# EAGLE design 2.1 (EAGLE 8.2.2)
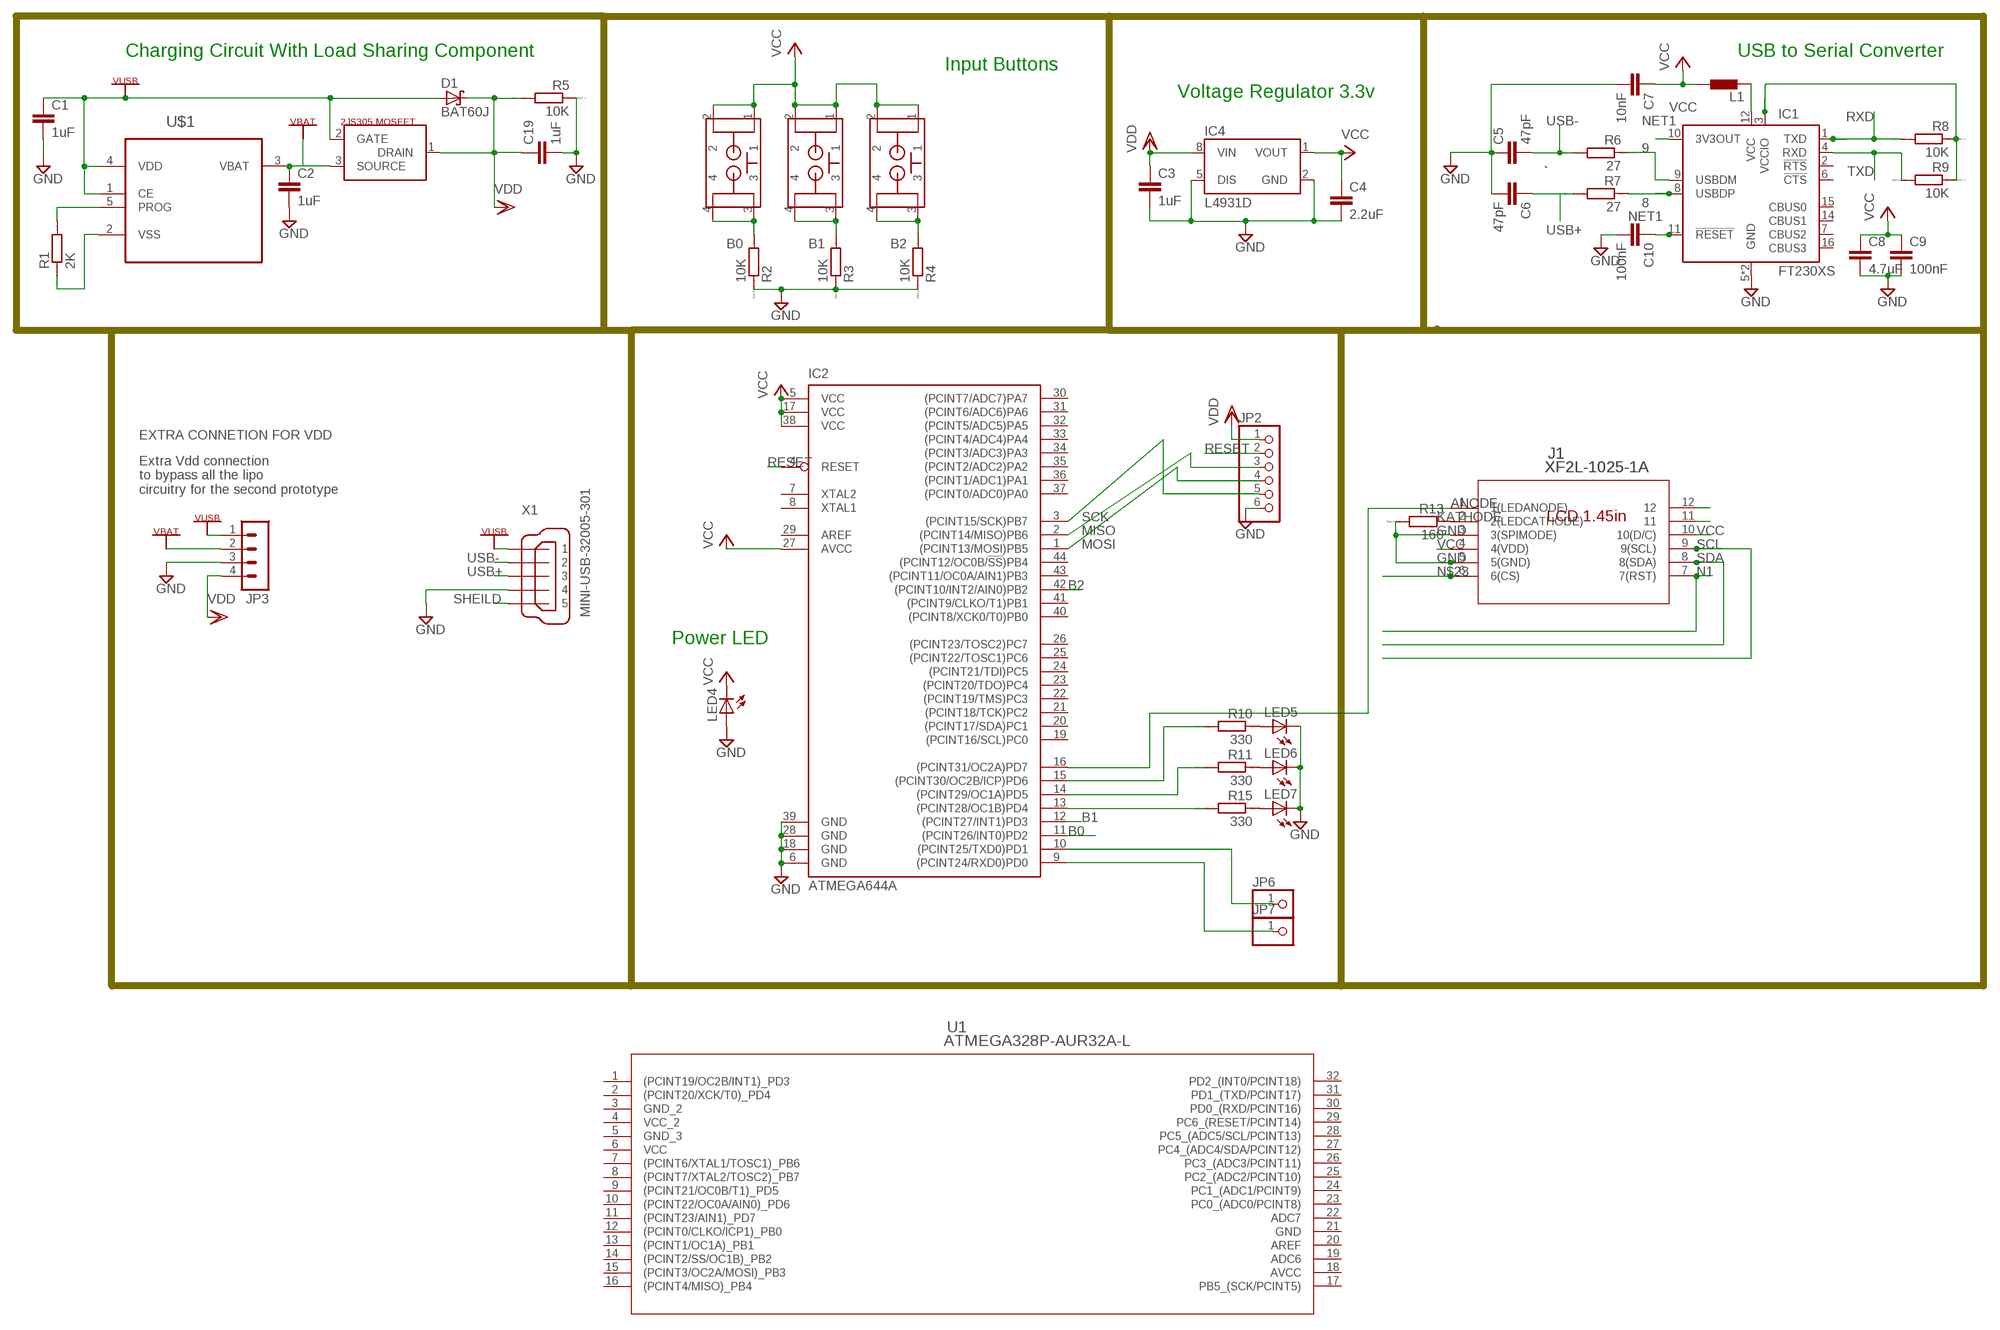
[diagram p0: schematic, sheet 1]

## Parts
C1  1uF  C-EUC0603K  [C0603K]
C2  1uF  C-EUC0603K  [C0603K]
C3  1uF  C-EUC0603K  [C0603K]
C4  2.2uF  C-EUC0603K  [C0603K]
C5  47pF  C-EUC0603K  [C0603K]
C6  47pF  C-EUC0603K  [C0603K]
C7  10nF  C-EUC0603K  [C0603K]
C8  4.7uF  C-EUC0603K  [C0603K]
C9  100nF  C-EUC0603K  [C0603K]
C10  100nF  C-EUC0603K  [C0603K]
C19  1uF  C-EUC0603K  [C0603K]
D1  BAT60J  [SOD323_ST]
IC1  FT230XS  [SSOP16]
IC2  ATMEGA644A  [TQFP44]
IC4  L4931D  [SO08]
J1  XF2L-1025-1A  [CON10_1X10_DBR_XF2L]
JP2  PINHD-1X6B  [1X06-BIG]
JP3  MA04-1  [MA04-1]
JP6  PINHD-1X1  [1X01]
JP7  PINHD-1X1  [1X01]
L1  BLM15HB221SN1  [0402]
LED4  LEDSMT1206  [1206]
LED5  LEDSMT1206  [1206]
LED6  LEDSMT1206  [1206]
LED7  LEDSMT1206  [1206]
R1  2K  RR0603  [R0603]
R2  10K  RR0603  [R0603]
R3  10K  RR0603  [R0603]
R4  10K  RR0603  [R0603]
R5  10K  RR0603  [R0603]
R6  27  RR0603  [R0603]
R7  27  RR0603  [R0603]
R8  10K  RR0603  [R0603]
R9  10K  RR0603  [R0603]
R10  330  RR0603  [R0603]
R11  330  RR0603  [R0603]
R13  160  RR0603  [R0603]
R15  330  RR0603  [R0603]
U1  ATMEGA328P-AUR32A-L  [32A-L]
U$1  MCP73812T-420I/OT  [SOT95P270X145-5N]
U$2  2JS305  [SOT346-R]
U$3  TL3315NF100Q  [TL3315NF100Q-PACKAGE]
U$4  TL3315NF100Q  [TL3315NF100Q-PACKAGE]
U$11  TL3315NF100Q  [TL3315NF100Q-PACKAGE]
X1  MINI-USB-32005-301  [32005-301]

## Nets
8: IC1.8(USBDP) R7.1
9: IC1.9(USBDM) R6.1
ANODE: IC2.16((PCINT31/OC2A)PD7) J1.1(1(LEDANODE))
B0: IC2.11((PCINT26/INT0)PD2) R2.2 U$3.3 U$3.4
B1: IC2.12((PCINT27/INT1)PD3) R3.2 U$4.3 U$4.4
B2: IC2.42((PCINT10/INT2/AIN0)PB2) R4.2 U$11.3 U$11.4
FTDI_VCC: IC1.12(VCC) L1.1
GND: C1.2 C2.2 C3.2 C4.2 C5.1 C6.2 C7.2 C8.2 C9.2 C10.2 C19.2 IC1.5(GND) IC1.13(GND) IC2.6(GND) IC2.18(GND) IC2.28(GND) IC2.39(GND) IC4.2(GND) IC4.5(DIS) J1.3(3(SPIMODE)) J1.5(5(GND)) JP2.6 JP3.3 LED4.A LED5.C LED6.C LED7.C R2.1 R3.1 R4.1 R5.1 R13.2 X1.4
KATHODE: J1.2(2(LEDCATHODE)) R13.1
MISO: IC2.2((PCINT14/MISO)PB6) JP2.3
MOSI: IC2.1((PCINT13/MOSI)PB5) JP2.4
N1: J1.7(7(RST))
N$1: R1.2 U$1.5(PROG)
N$2: R1.1 U$1.2(VSS)
N$11: LED5.A R10.1
N$12: LED6.A R11.1
N$13: LED7.A R15.1
N$15: IC2.13((PCINT28/OC1B)PD4) R15.2
N$16: IC2.14((PCINT29/OC1A)PD5) R11.2
N$20: IC2.15((PCINT30/OC2B/ICP)PD6) R10.2
N$23: J1.6(6(CS))
N$24: IC2.10((PCINT25/TXD0)PD1) JP6.1
N$26: J1.12
N$27: J1.11
NET1: C10.1 IC1.3(VCCIO) IC1.10(3V3OUT) IC1.11(!RESET) R8.1 R9.1
RESET: IC2.4(RESET) JP2.2
RXD: IC1.1(TXD) R8.2
RXD1: IC2.9((PCINT24/RXD0)PD0) JP7.1
SCK: IC2.3((PCINT15/SCK)PB7) JP2.5
SCL: J1.9(9(SCL))
SDA: J1.8(8(SDA))
SHEILD: X1.5
TXD: IC1.4(RXD) R9.2
USB+: C6.1 R7.2 X1.3
USB-: C5.2 R6.2 X1.2
VBAT: C2.1 JP3.2 U$1.3(VBAT) U$2.3(SOURCE)
VCC: C4.1 C7.1 C8.1 C9.1 IC2.5(VCC) IC2.17(VCC) IC2.27(AVCC) IC2.38(VCC) IC4.1(VOUT) J1.4(4(VDD)) J1.10(10(D/C)) L1.2 LED4.C U$3.1 U$3.2 U$4.1 U$4.2 U$11.1 U$11.2
VDD: C3.1 C19.1 D1.C IC4.8(VIN) JP2.1 JP3.4 R5.2 U$2.1(DRAIN)
VUSB: C1.1 D1.A JP3.1 U$1.1(CE) U$1.4(VDD) U$2.2(GATE) X1.1
Unconnected: IC1.2(!RTS) IC1.6(!CTS) IC1.7(CBUS2) IC1.14(CBUS1) IC1.15(CBUS0) IC1.16(CBUS3) IC2.7(XTAL2) IC2.8(XTAL1) IC2.19((PCINT16/SCL)PC0) IC2.20((PCINT17/SDA)PC1) IC2.21((PCINT18/TCK)PC2) IC2.22((PCINT19/TMS)PC3) IC2.23((PCINT20/TDO)PC4) IC2.24((PCINT21/TDI)PC5) IC2.25((PCINT22/TOSC1)PC6) IC2.26((PCINT23/TOSC2)PC7) IC2.29(AREF) IC2.30((PCINT7/ADC7)PA7) IC2.31((PCINT6/ADC6)PA6) IC2.32((PCINT5/ADC5)PA5) IC2.33((PCINT4/ADC4)PA4) IC2.34((PCINT3/ADC3)PA3) IC2.35((PCINT2/ADC2)PA2) IC2.36((PCINT1/ADC1)PA1) IC2.37((PCINT0/ADC0)PA0) IC2.40((PCINT8/XCK0/T0)PB0) IC2.41((PCINT9/CLKO/T1)PB1) IC2.43((PCINT11/OC0A/AIN1)PB3) IC2.44((PCINT12/OC0B/!SS!)PB4) U1.1((PCINT19/OC2B/INT1)_PD3) U1.2((PCINT20/XCK/T0)_PD4) U1.7((PCINT6/XTAL1/TOSC1)_PB6) U1.8((PCINT7/XTAL2/TOSC2)_PB7) U1.9((PCINT21/OC0B/T1)_PD5) U1.10((PCINT22/OC0A/AIN0)_PD6) U1.11((PCINT23/AIN1)_PD7) U1.12((PCINT0/CLKO/ICP1)_PB0) U1.13((PCINT1/OC1A)_PB1) U1.14((PCINT2/SS/OC1B)_PB2) U1.15((PCINT3/OC2A/MOSI)_PB3) U1.16((PCINT4/MISO)_PB4) U1.17(PB5_(SCK/PCINT5)) U1.19(ADC6) U1.20(AREF) U1.22(ADC7) U1.23(PC0_(ADC0/PCINT8)) U1.24(PC1_(ADC1/PCINT9)) U1.25(PC2_(ADC2/PCINT10)) U1.26(PC3_(ADC3/PCINT11)) U1.27(PC4_(ADC4/SDA/PCINT12)) U1.28(PC5_(ADC5/SCL/PCINT13)) U1.29(PC6_(RESET/PCINT14)) U1.30(PD0_(RXD/PCINT16)) U1.31(PD1_(TXD/PCINT17)) U1.32(PD2_(INT0/PCINT18))

## Notes on the sheet
- Charging Circuit With Load Sharing Component | USB to Serial Converter
- Input Buttons
- Voltage Regulator 3.3v
- EXTRA CONNETION FOR VDD
- Extra Vdd connection 
  to bypass all the lipo
  circuitry for the second prototype
- Power LED

## Power pins joined to a net without a drawn wire
AVCC: U1.18(AVCC)
GND: U1.21(GND)
GND_2: U1.3(GND_2)
GND_3: U1.5(GND_3)
VCC: U1.6(VCC)
VCC_2: U1.4(VCC_2)

## Library data of the parts
C1-C10 C19 = rcl:C-EU: CAPACITOR, European symbol
D1 = diode:BAT60J: Schottky barrier diode Source: www.st.com, BAT60J.pdf
IC1 = ft230x_10:FT230X: USB to Basic UART IC Source: http://www.ftdichip.com/Support/Documents/DataSheets/ICs/DS_FT230X.pdf; MF: FTDI; MPN: FT230XS; OC_FARNELL: 2081321; OC_NEWARK: 83T7087
IC2 = atmel:ATMEGA644: 8-bit Microcontroller with 64K Bytes In-System Programmable Flash Source: http://www.atmel.com/dyn/resources/prod_documents/doc2593.pdf; MPN: ATMEGA644PV-10AU; OC_FARNELL: 1455123; OC_NEWARK: 58M3748
IC4 = v-reg-3:L4931: STMicroelectronics <http://www.st.com> 250mA low dropout voltage regulator Vin 5V to 28V (transients 40V), disable pin, 50µA shutdown current
J1 = MyParts:XF2L-1025-1A; MANUFACTURER_PART_NUMBER: XF2L10251A; VENDOR: Omron
JP2 = adafruit:PINHD-1X6: PIN HEADER
JP3 = con-lstb:MA04-1: PIN HEADER; OC_FARNELL: unknown; OC_NEWARK: unknown
JP6 JP7 = adafruit:PINHD-1X1: Pin header 1x1 for 0.1" spacing With round pins
L1 = inductors:BLM15H: EMIFIL (R) Chip Ferrite Bead for GHz Noise Source: http://www.murata.com/ Ferrite Bead BLM15H.pdf
LED4-LED7 = adafruit:LED: LED OSRAM: - CHIPLED LG R971, LG N971, LY N971, LG Q971, LY Q971, LO R971, LY R971 LH N974, LH R974 LS Q976, LO Q976, LY Q976 LO Q996 - Hyper CHIPLED LW Q18S LB Q993, LB Q99A, LB R99A - SideLED LS A670, LO A670, LY A670, LG A670, LP A670 LB A673, LV A673, LT A673, LW A673 LH A674 LY A675 LS A676, LA A676, LO A676, LY A676, LW A676 LS A679, LY A679, LG A679 - Hyper Micro SIDELED® LS Y876, LA Y876, LO Y876, LY Y876 LT Y87S - SmartLED LW L88C, LW L88S LB L89C, LB L89S, LG L890 LS L89K, LO L89K, LY L89K LS L896, LA L896, LO L896, LY L896 - TOPLED LS T670, LO T670, LY T670, LG T670, LP T670 LSG T670, LSP T670, LSY T670, LOP T670, LYG T670 LG T671, LOG T671, LSG T671 LB T673, LV T673, LT T673, LW T673 LH T674 LS T676, LA T676, LO T676, LY T676, LB T676, LH T676, LSB T676, LW T676 LB T67C, LV T67C, LT T67C, LS T67K, LO T67K, LY T67K, LW E67C LS E67B, LA E67B, LO E67B, LY E67B, LB E67C, LV E67C, LT E67C LW T67C LS T679, LY T679, LG T679 LS T770, LO T770, LY T770, LG T770, LP T770 LB T773, LV T773, LT T773, LW T773 LH T774 LS E675, LA E675, LY E675, LS T675 LS T776, LA T776, LO T776, LY T776, LB T776 LHGB T686 LT T68C, LB T68C - Hyper Mini TOPLED® LB M676 - Mini TOPLED Santana® LG M470 LS M47K, LO M47K, LY M47K Source: http://www.osram.convergy.de/
R1-R5 R7-R11 R13 R15 = eagle-ltspice:R: RESISTOR, European symbol; SPICEMODEL: NONE; SPICEPREFIX: R
R6 = eagle-ltspice:R: RESISTOR, European symbol; SPICEMODEL: NONE; SPICEPREFIX: R6
U1 = MyParts:ATMEGA328P-AUR; MANUFACTURER_PART_NUMBER: ATMEGA328PAUR; VENDOR: Atmel
U$1 = Microchip_By_element14_Batch_1:MCP73812T-420I/OT: Charge Management Controller; MPN: MCP73812T-420I/OT; OC_FARNELL: 1627187; OC_NEWARK: 27M0232; PACKAGE: SOT-5; SUPPLIER: Microchip
U$2 = SOT346-R:2JS305
U$3 U$4 U$11 = MyParts:TL3315NF100Q
X1 = con-cypressindustries:MINI-USB-: MINI USB-B Conector Source: www.cypressindustries.com; OC_FARNELL: unknown; OC_NEWARK: unknown

## Module USBTOSERIAL
Ports: 

### Library data of the parts

## Board
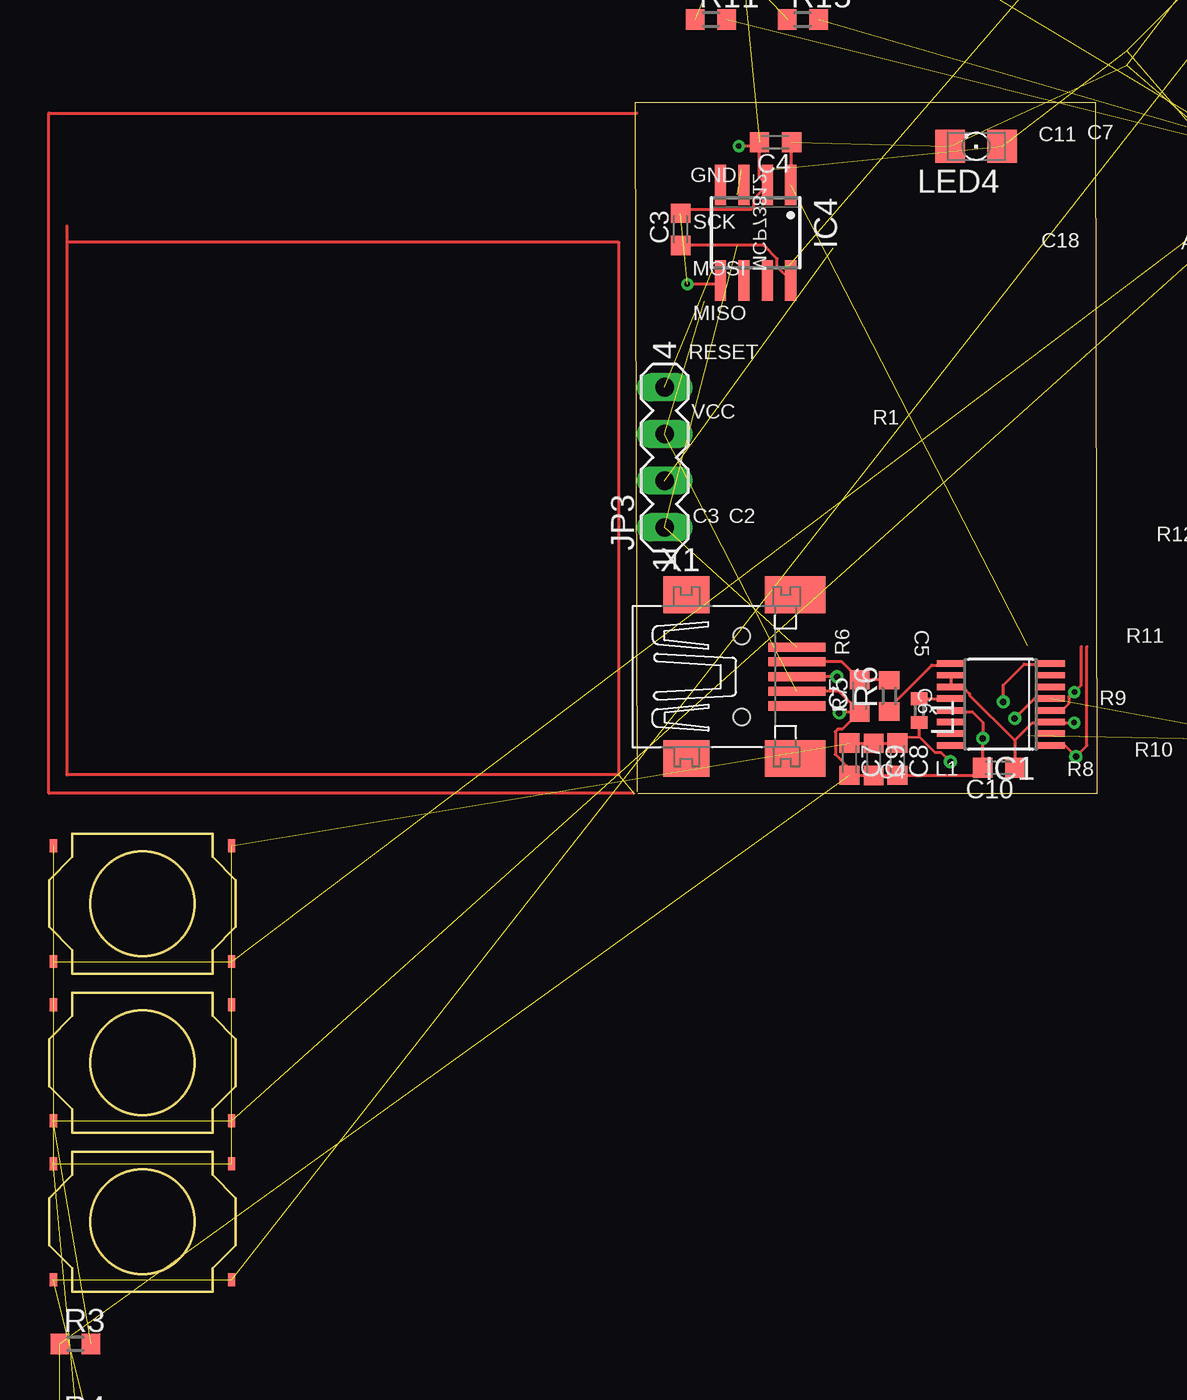
[diagram p1: board, top side]
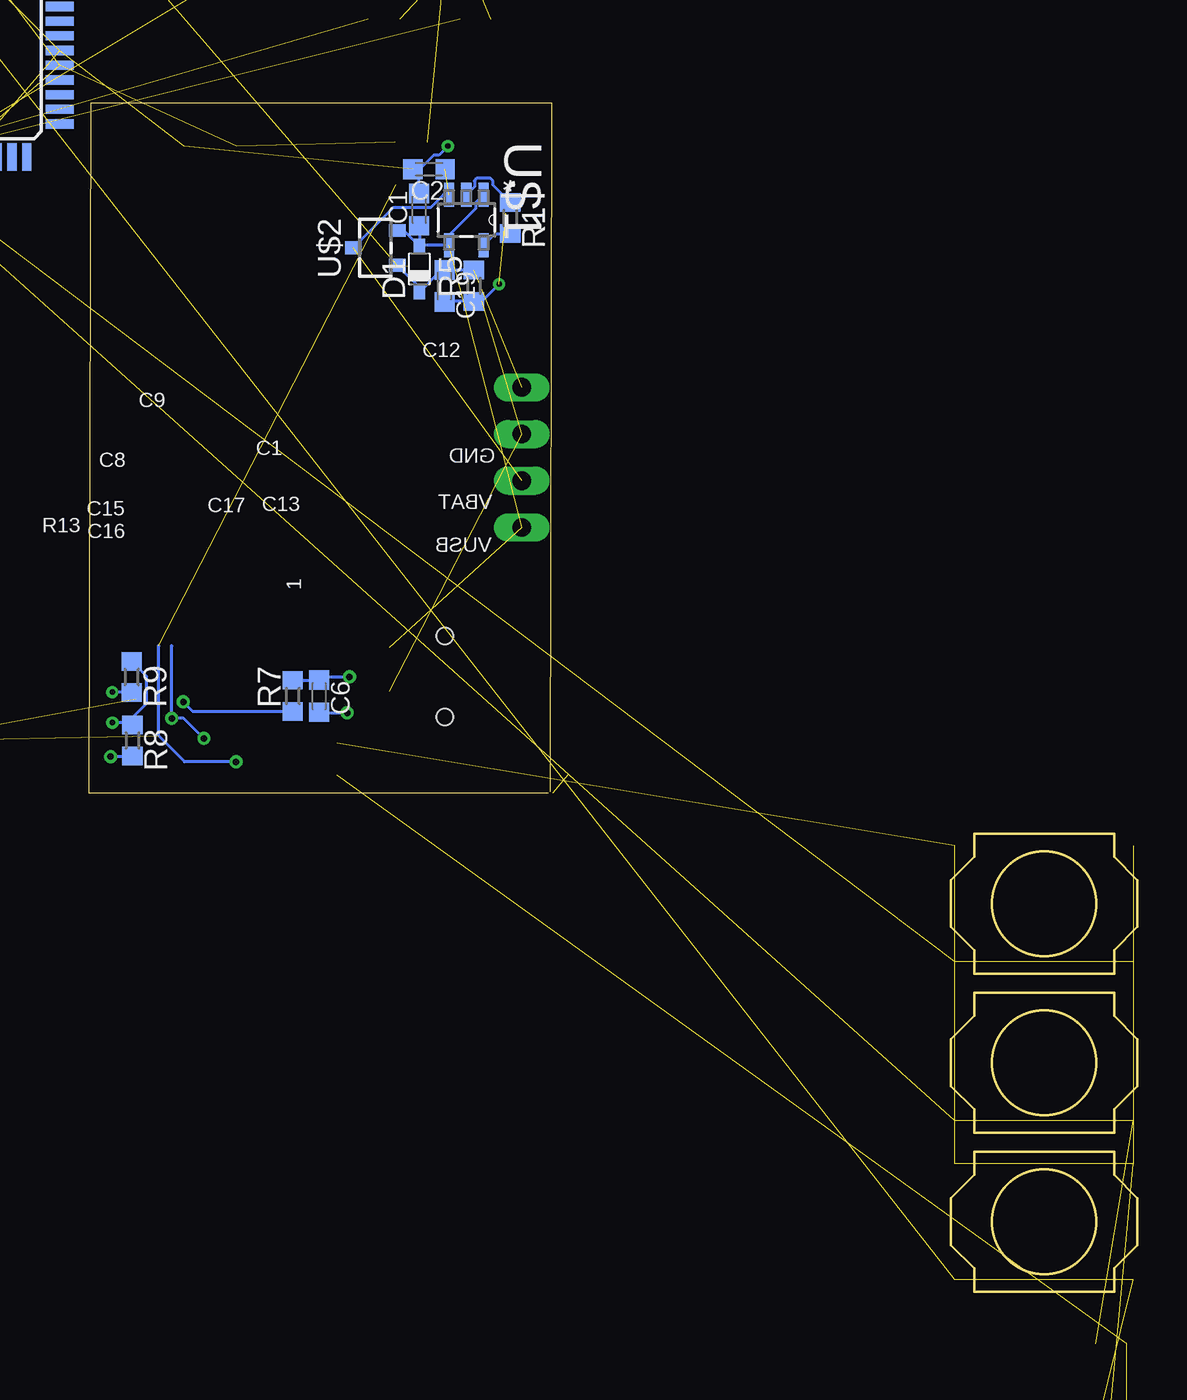
[diagram p2: board, bottom side, seen from below]

Size 57.05 x 64.67 mm. Coordinates in mm from the lower left corner, seen from the top.
Outline: 32.06,27.11 57.05,27.11 56.95,64.67 31.88,64.67 31.98,27.19
Copper layers (1*16): Top 0.0356mm / dielectric 1.5011mm / Bottom 0.0356mm
Design rules "oshpark-2layer *": minimum track width 6mil, minimum drill 10mil, track to track 6mil, track to pad 6mil, pad to pad 6mil, via to via 6mil, smd to smd 6mil, copper to edge 15mil, drill to drill 10mil, minimum pad ring 7mil, minimum via ring 7mil, stop-mask expansion 2.5mil, vias tented up to drill 0mil, thermal gap 10mil

### Footprints (pad centres in the part's own frame; a part is rotated, then mirrored left to right if it is on the bottom)
C0603K = smd 1.05 x 1.08: 1 -0.875,0; 2 0.875,0
SOD323_ST = smd 0.8 x 0.6: A 1.25,0; C -1.25,0
SSOP16 = smd 0.35 x 1.55: 1 -2.223,-2.7; 2 -1.587,-2.7; 3 -0.953,-2.7; 4 -0.318,-2.7; 5 0.318,-2.7; 6 0.953,-2.7; 7 1.587,-2.7; 8 2.223,-2.7; 9 2.223,2.7; 10 1.587,2.7; 11 0.953,2.7; 12 0.318,2.7; 13 -0.318,2.7; 14 -0.953,2.7; 15 -1.587,2.7; 16 -2.223,2.7
TQFP44 = smd 1.5 x 0.5: 1 -5.8,4; 2 -5.8,3.2; 3 -5.8,2.4; 4 -5.8,1.6; 5 -5.8,0.8; 6 -5.8,0; 7 -5.8,-0.8; 8 -5.8,-1.6; 9 -5.8,-2.4; 10 -5.8,-3.2; 11 -5.8,-4; 23 5.8,-4; 24 5.8,-3.2; 25 5.8,-2.4; 26 5.8,-1.6; 27 5.8,-0.8; 28 5.8,0; 29 5.8,0.8; 30 5.8,1.6; 31 5.8,2.4; 32 5.8,3.2; 33 5.8,4 | smd 0.5 x 1.5: 12 -4,-5.8; 13 -3.2,-5.8; 14 -2.4,-5.8; 15 -1.6,-5.8; 16 -0.8,-5.8; 17 0,-5.8; 18 0.8,-5.8; 19 1.6,-5.8; 20 2.4,-5.8; 21 3.2,-5.8; 22 4,-5.8; 34 4,5.8; 35 3.2,5.8; 36 2.4,5.8; 37 1.6,5.8; 38 0.8,5.8; 39 0,5.8; 40 -0.8,5.8; 41 -1.6,5.8; 42 -2.4,5.8; 43 -3.2,5.8; 44 -4,5.8
SO08 = smd 0.6 x 2.2: 1 -1.905,-2.6; 2 -0.635,-2.6; 3 0.635,-2.6; 4 1.905,-2.6; 5 1.905,2.6; 6 0.635,2.6; 7 -0.635,2.6; 8 -1.905,2.6
CON10_1X10_DBR_XF2L = smd 0.254 x 1.016: 1 2.25,2.286; 2 1.75,2.286; 3 1.25,2.286; 4 0.75,2.286; 5 0.25,2.286; 6 -0.25,2.286; 7 -0.75,2.286; 8 -1.25,2.286; 9 -1.75,2.286; 10 -2.25,2.286 | smd 1.016 x 1.346: 11 -4.572,4.013; 12 4.572,4.013
1X06-BIG = drill 1.016 pad 1.778 octagon: 1 -6.35,0; 2 -3.81,0; 3 -1.27,0; 4 1.27,0; 5 3.81,0; 6 6.35,0
MA04-1 = drill 1.016 long: 1 -3.81,0; 2 -1.27,0; 3 1.27,0; 4 3.81,0
1X01 = drill 1.016 pad 1.93 octagon: 1 0,0
0402 = smd 0.7 x 0.9: 1 -0.65,0; 2 0.65,0
1206 = smd 1.6 x 1.803: A -1.422,0; C 1.422,0
R0603 = smd 1 x 1.1: 1 -0.85,0; 2 0.85,0
32A-L = smd 1.168 x 0.229: 1 -3.124,1.751; 2 -3.124,1.251; 3 -3.124,0.751; 4 -3.124,0.25; 5 -3.124,-0.25; 6 -3.124,-0.751; 7 -3.124,-1.251; 8 -3.124,-1.751; 17 3.124,-1.751; 18 3.124,-1.251; 19 3.124,-0.751; 20 3.124,-0.25; 21 3.124,0.25; 22 3.124,0.751; 23 3.124,1.251; 24 3.124,1.751 | smd 0.229 x 1.168: 9 -1.751,-3.124; 10 -1.251,-3.124; 11 -0.751,-3.124; 12 -0.25,-3.124; 13 0.25,-3.124; 14 0.751,-3.124; 15 1.251,-3.124; 16 1.751,-3.124; 25 1.751,3.124; 26 1.251,3.124; 27 0.751,3.124; 28 0.25,3.124; 29 -0.25,3.124; 30 -0.751,3.124; 31 -1.251,3.124; 32 -1.751,3.124
SOT95P270X145-5N = smd 1.321 x 0.559: 1 -1.372,0.94; 2 -1.372,0; 3 -1.372,-0.94; 4 1.372,-0.94; 5 1.372,0.94
SOT346-R = smd 0.7 x 0.9: 1 -0.95,-1.2; 2 0.95,-1.2; 3 0,1.2
TL3315NF100Q-PACKAGE = smd 0.4 x 0.7: 1 -4.85,3.15; 2 4.85,3.15; 3 -4.85,-3.15; 4 4.85,-3.15
32005-301 = smd 3.1 x 0.5: 1 3,1.6; 2 3,0.8; 3 3,0; 4 3,-0.8; 5 3,-1.6 | smd 2.5 x 2: M1 -3,-4.45; M2 -3,4.45 | smd 3.3 x 2: M3 2.9,4.45; M4 2.9,-4.45 | hole 0.9: 0,2.2; 0,-2.2

### Placement (x,y rotation side)
C1  39.09,58.86 90 bottom
C2  38.55,61.06 180 bottom
C3  34.37,57.79 90 top
C4  39.53,62.53 180 top
C5  44.11,32.41 90 top
C6  44.53,32.4 270 bottom
C7  43.56,28.97 270 top
C8  46.16,28.97 270 top
C9  44.87,28.96 270 top
C10  51.68,28.5 180 top
C19  37.71,54.7 270 bottom
D1  39.08,55.63 90 bottom
IC1  51.78,31.95 90 top
IC2  64.45,67.51 0 bottom
IC4  38.45,57.61 180 top
J1  68.11,27.67 0 bottom  (outside the outline)
JP2  102.98,121.11 0 top  (outside the outline)
JP3  33.5,45.38 90 top
JP6  97.98,102.11 0 top  (outside the outline)
JP7  97.98,82.11 0 top  (outside the outline)
L1  47.35,31.61 270 top
LED4  50.45,62.3 180 top
LED5  36.02,82.2 0 top  (outside the outline)
LED6  42.02,82.2 0 top  (outside the outline)
LED7  36.02,75.2 0 top  (outside the outline)
R1  34.13,58.41 270 bottom
R2  99.99,49.08 180 top  (outside the outline)
R3  1.43,-2.84 0 top
R4  1.43,-7.59 0 top  (outside the outline)
R5  36.11,54.72 90 bottom
R6  45.72,32.41 90 top
R7  45.97,32.41 90 bottom
R8  54.69,29.99 270 bottom
R9  54.73,33.44 270 bottom
R10  41.02,76.2 0 top  (outside the outline)
R11  36.02,69.2 0 top  (outside the outline)
R13  66.32,27.04 90 bottom  (outside the outline)
R15  41.02,69.2 0 top  (outside the outline)
U1  5.38,-14.29 0 top  (outside the outline)
U$1  36.52,58.3 270 bottom
U$2  41.48,56.78 90 bottom
U$3  5.08,21.11 0 top
U$4  5.08,12.46 0 top
U$11  5.08,3.81 0 top
X1  37.69,33.46 0 top

### Tracks (layer width: path | path; a pad name or v marks a point on that pad's centre or on a via)
8  (via drill 0.35)
  Top 0.152: v51.92,32.08 51.92,33 53.06,34.14 54.46,34.14 IC1.8
  Bottom 0.152: R7.1 51.4,31.56 v51.92,32.08
9
  Top 0.152: R6.1 45.72,31.78 48.03,34.09 49.01,34.09 IC1.9
ANODE  (1 unrouted)
B0  (3 unrouted)
B1  (3 unrouted)
B2  (3 unrouted)
FTDI_VCC
  Top 0.152: L1.1 IC1.12
GND  (via drill 0.3, 0.35)  (19 unrouted)
  Top 0.152: C5.1 42.99,32.66 X1.4 | v43,31.49 43,31.54 C5.1 | C5.1 43.17,30.6 42.92,30.6 42.79,30.46 42.79,29.22 43.55,28.45 C7.2 C9.2 46.09,28.08 C8.2 46.1,28.09 50.41,28.1 C10.2 v50.8,30.1 50.8,30.99 50.25,31.54 49.17,31.54 IC1.13 | IC1.5 53.62,32.26 v52.55,31.19 | C3.2 34.58,58.88 38.21,58.88 38.34,59.01 38.34,59.47 IC4.2 38.66,60.63 C4.2 38.44,62.31 v37.53,62.31 | IC4.5 36.35,54.81 v34.73,54.81
  Bottom 0.152: C6.2 44.53,31.49 v43,31.49 | v50.8,30.1 51.89,31.19 v52.55,31.19 52.55,35.12 52.57,35.14 | C1.2 39.09,60.71 C2.2 39.06,61.05 38.3,61.82 38.02,61.82 v37.53,62.31 | C19.2 37.67,53.87 R5.1 35.67,53.87 v34.73,54.81
KATHODE  (1 unrouted)
MISO  (1 unrouted)
MOSI  (1 unrouted)
N$1
  Bottom 0.152: U$1.5 34.95,57.56 R1.2
N$2
  Bottom 0.152: U$1.2 36.09,60.1 36.09,60.43 35.95,60.56 35.21,60.56 35.07,60.43 35.07,60.2 R1.1
N$4  (1 unrouted)
  Top 0.152: 31.98,64.11 -0.02,64.11 -0.02,27.11 31.83,27.11 | 0.98,57.11 0.98,28.11 30.98,28.11 30.98,57.11 0.98,57.11 | 0.98,57.11 0.98,57.96
N$11  (1 unrouted)
N$12  (1 unrouted)
N$13  (1 unrouted)
N$15  (1 unrouted)
N$16  (1 unrouted)
N$20  (1 unrouted)
N$24  (1 unrouted)
NET1  (via drill 0.3)
  Top 0.152: 52.55,29.99 C10.1 | 52.55,29.99 53.47,30.91 54.4,30.91 | 54.4,30.91 IC1.3 | IC1.10 IC1.11 49.72,32.9 50.09,32.53 50.09,32.46 52.55,29.99 | v55.78,30.96 55.73,30.91 54.4,30.91
  Bottom 0.152: R9.1 53.95,33.51 53.95,31.99 54.69,31.26 R8.1 54.81,30.96 v55.78,30.96
RESET  (1 unrouted)
RXD  (via drill 0.35)
  Top 0.152: IC1.1 55.27,29.72 v55.88,29.11 56.48,29.71 56.48,35.11
  Bottom 0.152: R8.2 54.71,29.11 v55.88,29.11
RXD1  (1 unrouted)
SCK  (1 unrouted)
TXD  (via drill 0.3)
  Top 0.152: IC1.4 55.12,31.63 55.49,31.99 55.49,32.36 v55.79,32.61 56.17,32.99 56.17,35.11
  Bottom 0.152: R9.2 54.75,32.61 v55.79,32.61
USB+  (via drill 0.35)
  Top 0.152: v42.88,33.45 v42.88,33.46 X1.3
  Bottom 0.152: v42.88,33.45 44.53,33.45 C6.1 45.97,33.27 R7.2
USB-
  Top 0.152: X1.2 43.14,34.26 C5.2 45.69,33.29 R6.2
VBAT  (2 unrouted)
  Bottom 0.152: U$2.3 40.48,58.98 38.45,58.98 37.76,59.67 U$1.3
VCC  (via drill 0.35)  (15 unrouted)
  Top 0.152: C7.1 C9.1 46.09,29.83 C8.1 46.43,30.17 47.35,30.18 | v49.05,28.82 48.55,29.32 48.21,29.32 47.35,30.18 | 47.35,30.18 L1.2 | C4.1 40.35,62.48 IC4.1
  Bottom 0.152: v49.05,28.82 51.85,28.82 53.26,30.23 53.26,35.13 53.27,35.14
VDD  (3 unrouted)
  Top 0.152: IC4.8 39.61,55.75 39.61,56.2 38.9,56.92 C3.1
  Bottom 0.152: R5.2 C19.1 37.88,55.58 D1.C 39.08,54.63 U$2.1
VUSB  (2 unrouted)
  Bottom 0.152: C1.1 D1.A | D1.A 39.93,57.73 U$2.2 | D1.A 39.03,56.93 U$1.4 37.46,57.47 36.01,58.92 36.01,59.24 U$1.1

### Text on the board
tSilk: C11 | C7 | GND | SCK | C18 | ATMEGA32U4 | R4 | MOSI | MISO | RESET | VCC | R1 | R2 | C3 | C2 | R12 | R19 | C10 | R3 | R6 | C5 | R11 | R7 | C6 | R18 | TX | R9 | R10 | RX | C4 | L1 | R8 | R17
bSilk: C12 | C9 | C1 | GND | C8 | VBAT | C13 | C17 | C16 | C15 | R14 | R13 | VUSB | 1 | 30 | C14